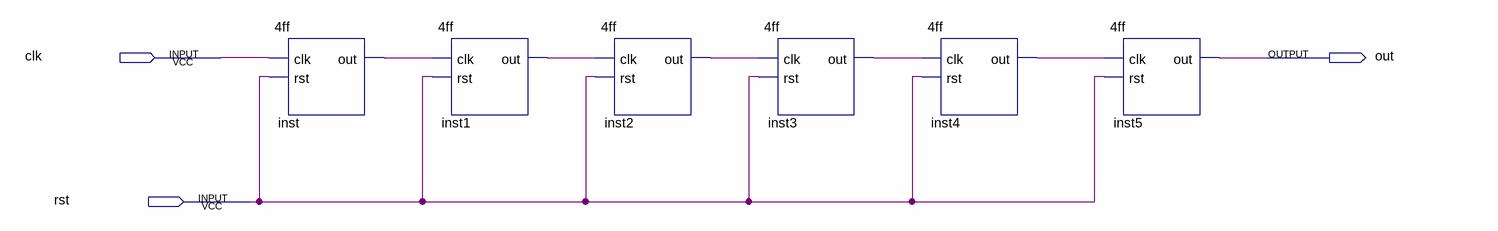
[diagram p0: schematic sheet]
// Quartus schematic lab05.bdf as structural Verilog: 6 symbols, 3 pins
module lab05 (
  input  clk,
  input  rst,
  output out
);

  wire inst1_out, inst2_out, inst3_out, inst4_out, inst_out;

  \4ff  inst (.clk(clk), .rst(rst), .out(inst_out));
  \4ff  inst1 (.clk(inst_out), .rst(rst), .out(inst1_out));
  \4ff  inst2 (.clk(inst1_out), .rst(rst), .out(inst2_out));
  \4ff  inst3 (.clk(inst2_out), .rst(rst), .out(inst3_out));
  \4ff  inst4 (.clk(inst3_out), .rst(rst), .out(inst4_out));
  \4ff  inst5 (.clk(inst4_out), .rst(rst), .out(out));
endmodule
